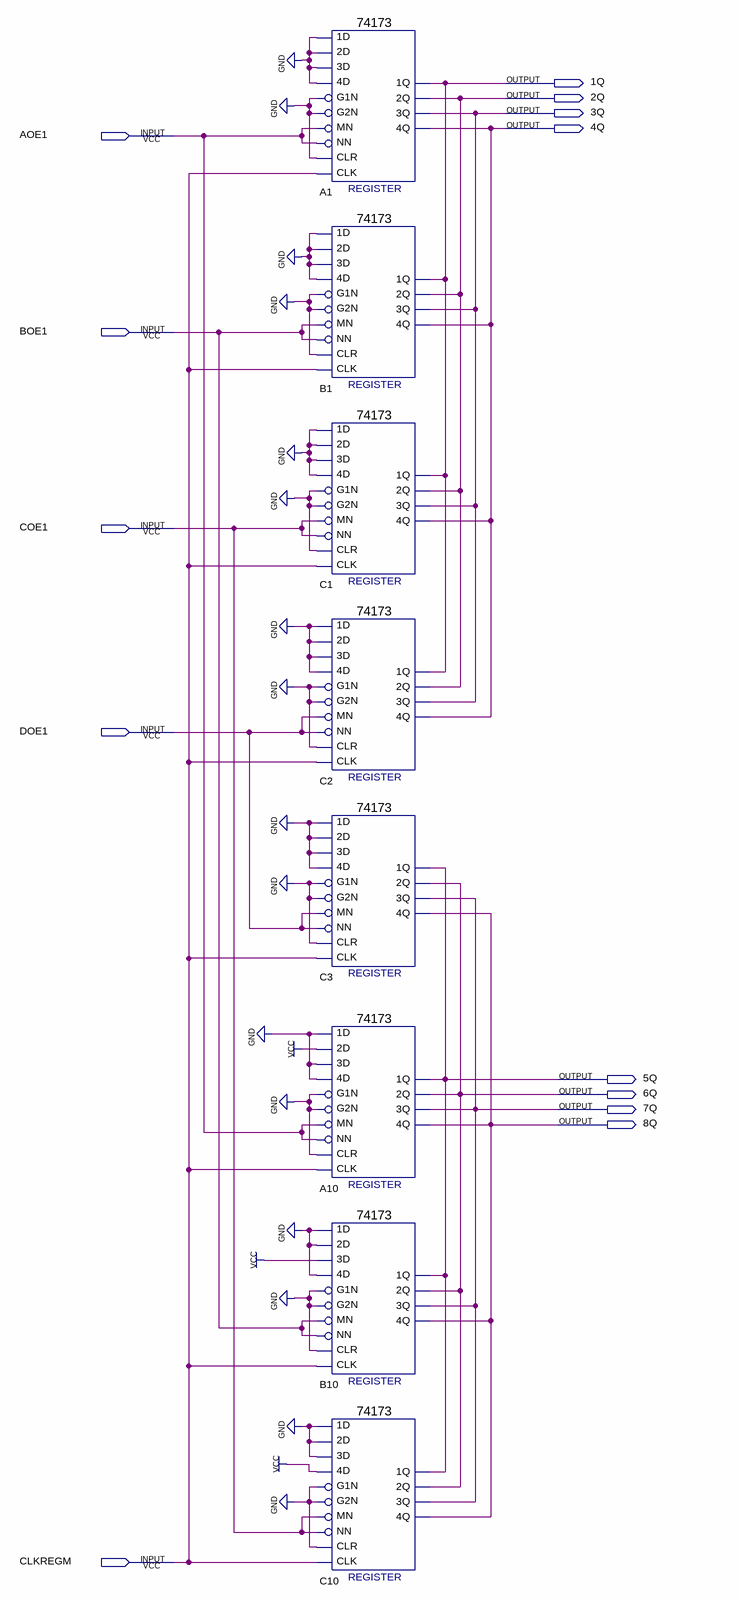
[diagram p0: schematic sheet]
// Quartus schematic Pedagio.bdf as structural Verilog: 8 symbols, 13 pins
module Pedagio (
  input  AOE1,
  input  BOE1,
  input  COE1,
  input  DOE1,
  input  CLKREGM,
  output \1Q ,
  output \2Q ,
  output \3Q ,
  output \4Q ,
  output \5Q ,
  output \6Q ,
  output \7Q ,
  output \8Q 
);

  \74173  A1 (
    .\3D (1'b0), .MN(AOE1), .\1D (1'b0), .\2D (1'b0), .\4D (1'b0), .G1N(1'b0), .G2N(1'b0), .NN(AOE1),
    .CLR(1'b0), .CLK(CLKREGM), .\3Q (\3Q ), .\2Q (\2Q ), .\1Q (\1Q ), .\4Q (\4Q ));
  \74173  B1 (
    .\3D (1'b0), .MN(BOE1), .\1D (1'b0), .\2D (1'b0), .\4D (1'b0), .G1N(1'b0), .G2N(1'b0), .NN(BOE1),
    .CLR(1'b0), .CLK(CLKREGM), .\3Q (\3Q ), .\2Q (\2Q ), .\1Q (\1Q ), .\4Q (\4Q ));
  \74173  C1 (
    .\3D (1'b0), .MN(COE1), .\1D (1'b0), .\2D (1'b0), .\4D (1'b0), .G1N(1'b0), .G2N(1'b0), .NN(COE1),
    .CLR(1'b0), .CLK(CLKREGM), .\3Q (\3Q ), .\2Q (\2Q ), .\1Q (\1Q ), .\4Q (\4Q ));
  \74173  C2 (
    .\3D (1'b0), .MN(DOE1), .\1D (1'b0), .\2D (1'b0), .\4D (1'b0), .G1N(1'b0), .G2N(1'b0), .NN(DOE1),
    .CLR(1'b0), .CLK(CLKREGM), .\3Q (\3Q ), .\2Q (\2Q ), .\1Q (\1Q ), .\4Q (\4Q ));
  \74173  C3 (
    .\3D (1'b0), .MN(DOE1), .\1D (1'b0), .\2D (1'b0), .\4D (1'b0), .G1N(1'b0), .G2N(1'b0), .NN(DOE1),
    .CLR(1'b0), .CLK(CLKREGM), .\3Q (\7Q ), .\2Q (\6Q ), .\1Q (\5Q ), .\4Q (\8Q ));
  \74173  A10 (
    .\3D (1'b0), .MN(AOE1), .\1D (1'b0), .\2D (1'b1), .\4D (1'b0), .G1N(1'b0), .G2N(1'b0), .NN(AOE1),
    .CLR(1'b0), .CLK(CLKREGM), .\3Q (\7Q ), .\2Q (\6Q ), .\1Q (\5Q ), .\4Q (\8Q ));
  \74173  B10 (
    .\3D (1'b1), .MN(BOE1), .\1D (1'b0), .\2D (1'b0), .\4D (1'b0), .G1N(1'b0), .G2N(1'b0), .NN(BOE1),
    .CLR(1'b0), .CLK(CLKREGM), .\3Q (\7Q ), .\2Q (\6Q ), .\1Q (\5Q ), .\4Q (\8Q ));
  \74173  C10 (
    .\3D (1'b0), .MN(COE1), .\1D (1'b0), .\2D (1'b0), .\4D (1'b1), .G1N(1'b0), .G2N(1'b0), .NN(COE1),
    .CLR(1'b0), .CLK(CLKREGM), .\3Q (\7Q ), .\2Q (\6Q ), .\1Q (\5Q ), .\4Q (\8Q ));
endmodule
